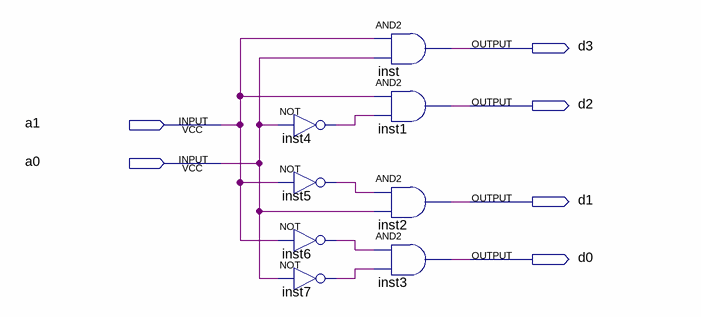
[diagram p0: schematic sheet]
// Quartus schematic 2-4.bdf as structural Verilog: 8 symbols, 6 pins
module \2-4  (
  input  a1,
  input  a0,
  output d3,
  output d2,
  output d1,
  output d0
);

  wire inst4_out, inst5_out, inst6_out, inst7_out;

  not inst4 (inst4_out, a0);
  not inst5 (inst5_out, a1);
  not inst6 (inst6_out, a1);
  not inst7 (inst7_out, a0);
  and inst (d3, a1, a0);
  and inst1 (d2, a1, inst4_out);
  and inst2 (d1, inst5_out, a0);
  and inst3 (d0, inst6_out, inst7_out);
endmodule
